# Altium schematic sheet Sheet1.SchDoc
size A3; SheetNumber: 1; SheetTotal: 1
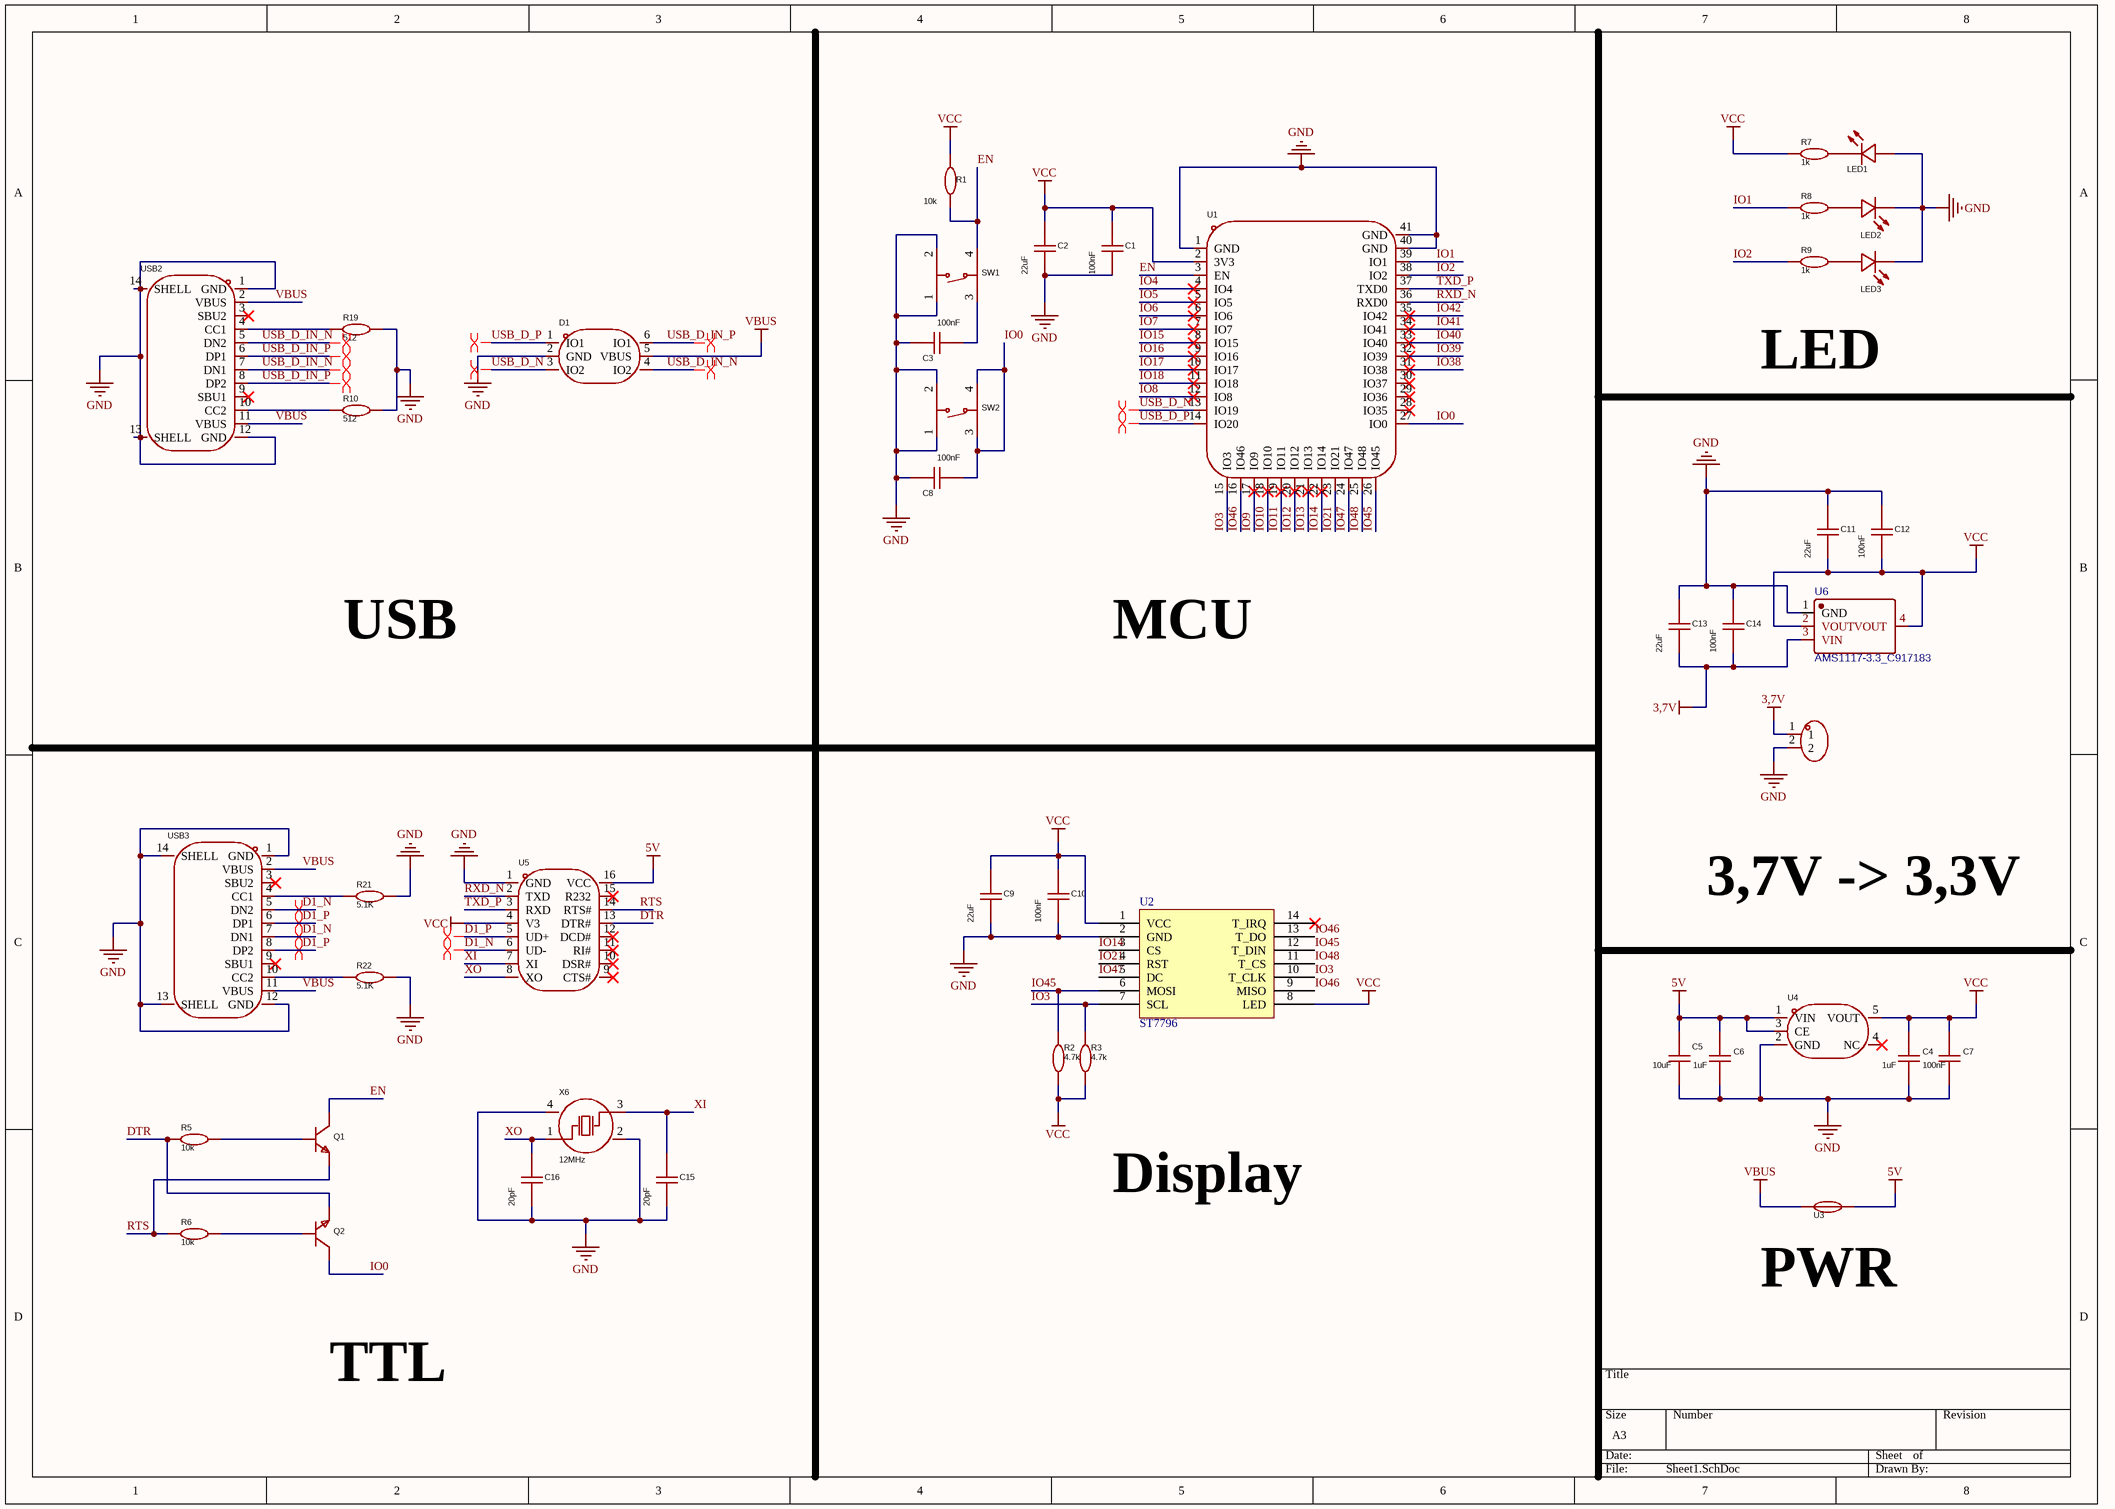
[diagram p0: Sheet1.SchDoc]

## Parts
C1  100nF  [C0402]
C2  22uF  [C0402]
C3  100nF  [C0402]
C4  1uF  [C0402]
C5  10uF  [C0402]
C6  1uF  [C0402]
C7  100nF  [C0402]
C8  100nF  [C0402]
C9  22uF  [C0402]
C10  100nF  [C0402]
C11  22uF  [C0402]
C12  100nF  [C0402]
C13  22uF  [C0402]
C14  100nF  [C0402]
C15  20pF  [C0402]
C16  20pF  [C0402]
D1  USBLC6-2SC6  [SOT-23-6_L2.9-W1.6-P0.95-LS2.8-BL]  (value not drawn)
LED1  MHT192WDT-CYAN  [LED0603-Yel]  (value not drawn)
LED2  MHT192WDT-CYAN  [LED0603-R-RD_BLUE]  (value not drawn)
LED3  MHT192WDT-CYAN  [LED0603-R-RD_BLUE]  (value not drawn)
Q1  S8050  [SOT-23-3_L2.9-W1.3-P1.90-LS2.4-BR]  (value not drawn)
Q2  S8050  [SOT-23-3_L2.9-W1.3-P1.90-LS2.4-BR]  (value not drawn)
R1  10k  [R0402]
R2  4.7k  [R0402]
R3  4.7k  [R0402]
R5  10k  [R0402]
R6  10k  [R0402]
R7  1k  [R0402]
R8  1k  [R0402]
R9  1k  [R0402]
R10  512  [R0402]
R19  512  [R0402]
R21  5.1K  [R0402]
R22  5.1K  [R0402]
SW1  TS-1089S-02526  [SW-SMD_4P-L4.2-W3.3-P2.15-LS5.1]  (value not drawn)
SW2  TS-1089S-02526  [SW-SMD_4P-L4.2-W3.3-P2.15-LS5.1]  (value not drawn)
U1  ESP32-S3-WROOM-1-N16R2  [WIRELM-SMD_ESP32-S3-WROOM-1]  (value not drawn)
U2  ST7796  [ST7796]
U3  SMD0805B050TF  [F0805]  (value not drawn)
U4  RT9013-33GB-JSM  [SOT-23-5_L2.9-W1.6-P0.95-LS2.8-BR]  (value not drawn)
U5  CH340G  [SOIC-16_L9.9-W3.9-P1.27-LS6.0-BL]  (value not drawn)
U6  AMS1117-3.3_C917183  [SOT-223-3_L6.7-W3.7-P2.30-LS7.0-BR]
U7  WAFER-XH254Z-2A  [CONN-TH_2P-P2.50_XH-2A_3045048]  (value not drawn)
USB2  TYPE-C 16PIN 2MD(073)  [USB-C-SMD_TYPE-C-6PIN-2MD-073]  (value not drawn)
USB3  TYPE-C 16PIN 2MD(073)  [USB-C-SMD_TYPE-C-6PIN-2MD-073]  (value not drawn)
X6  12MHz  [CRYSTAL-SMD_4P-L3.2-W2.5-BL]

## Nets
3,7V: C13.1 C14.1 U6.3(VIN) U7.1
5V: C5.1 C6.2 U3.2 U4.1(VIN) U4.3(CE) U5.16(VCC)
GND: C1.1 C2.1 C3.2 C4.1 C5.2 C6.1 C7.1 C8.2 C9.1 C10.1 C11.2 C12.2 C13.2 C14.2 C15.1 C16.1 D1.2(GND) LED1.2(K) LED2.1(A) LED3.1(A) R10.1 R19.1 R21.1 R22.1 SW1.1 SW1.2 SW2.1 SW2.2 U1.1(GND) U1.40(GND) U1.41(GND) U2.2(GND) U4.2(GND) U5.1(GND) U6.1(GND) U7.2 USB2.1(GND) USB2.12(GND) USB2.13(SHELL) USB2.14(SHELL) USB3.1(GND) USB3.12(GND) USB3.13(SHELL) USB3.14(SHELL) X6.2(GND) X6.4(GND)
VBUS: D1.5(VBUS) U3.1 USB2.2(VBUS) USB2.11(VBUS) USB3.2(VBUS) USB3.11(VBUS)
VCC: C1.2 C2.2 C4.2 C7.2 C9.2 C10.2 C11.1 C12.1 R1.2 R2.2 R3.2 R7.2 U1.2(3V3) U2.1(VCC) U2.8(LED) U4.5(VOUT) U5.4(V3) U6.2(VOUT) U6.4(VOUT)
D1_N: U5.6(UD-) USB3.5(DN2) USB3.7(DN1)
D1_P: U5.5(UD+) USB3.6(DP1) USB3.8(DP2)
DTR: Q2.2(E) R5.2 U5.13(DTR#)
EN: Q1.3(C) R1.1 SW1.4 U1.3(EN)
IO0: C8.1 Q2.3(C) SW2.3 SW2.4 U1.27(IO0)
IO1: R8.2 U1.39(IO1)
IO2: R9.2 U1.38(IO2)
IO3: R3.1 U1.15(IO3) U2.7(SCL) U2.10(T_CLK)
IO4: U1.4(IO4)
IO5: U1.5(IO5)
IO6: U1.6(IO6)
IO7: U1.7(IO7)
IO8: U1.12(IO8)
IO9: U1.17(IO9)
IO10: U1.18(IO10)
IO11: U1.19(IO11)
IO12: U1.20(IO12)
IO13: U1.21(IO13)
IO14: U1.22(IO14) U2.3(CS)
IO15: U1.8(IO15)
IO16: U1.9(IO16)
IO17: U1.10(IO17)
IO18: U1.11(IO18)
IO21: U1.23(IO21) U2.4(RST)
IO38: U1.31(IO38)
IO39: U1.32(IO39)
IO40: U1.33(IO40)
IO41: U1.34(IO41)
IO42: U1.35(IO42)
IO45: R2.1 U1.26(IO45) U2.6(MOSI) U2.12(T_DIN)
IO46: U1.16(IO46) U2.9(MISO) U2.13(T_DO)
IO47: U1.24(IO47) U2.5(DC)
IO48: U1.25(IO48) U2.11(T_CS)
RTS: Q1.2(E) R6.2 U5.14(RTS#)
RXD_N: U1.36(RXD0) U5.2(TXD)
TXD_P: U1.37(TXD0) U5.3(RXD)
USB_D_IN_N: D1.4(IO2) USB2.5(DN2) USB2.7(DN1)
USB_D_IN_P: D1.6(IO1) USB2.6(DP1) USB2.8(DP2)
USB_D_N: D1.3(IO2) U1.13(IO19)
USB_D_P: D1.1(IO1) U1.14(IO20)
XI: C15.2 U5.7(XI) X6.3(OSC2)
XO: C16.2 U5.8(XO) X6.1(OSC1)
NetC3_1: C3.1 SW1.3
NetLED1_1: LED1.1(A) R7.1
NetLED2_2: LED2.2(K) R8.1
NetLED3_2: LED3.2(K) R9.1
NetQ1_1: Q1.1(B) R5.1
NetQ2_1: Q2.1(B) R6.1
NetR10_2: R10.2 USB2.10(CC2)
NetR19_2: R19.2 USB2.4(CC1)
NetR21_2: R21.2 USB3.4(CC1)
NetR22_2: R22.2 USB3.10(CC2)

Not connected (* = marked no-connect by the designer): U1 28(IO35)* 29(IO36)* 30(IO37)*; U2 14(T_IRQ)*; U4 4(NC)*; U5 9(CTS#)* 10(DSR#)* 11(RI#)* 12(DCD#)* 15(R232)*; USB2 3(SBU2)* 9(SBU1)*; USB3 3(SBU2)* 9(SBU1)*

## Layout directives
differential pair: D1_N, D1_P, USB_D_IN_N, USB_D_IN_P, USB_D_N, USB_D_P

## Notes on the sheet
- LED
- USB
- MCU
- 3,7V -> 3,3V
- Display
- (near U3) PWR
- TTL

## Library data of the parts
C1 C3 C7 C8 C10 C12 C14 = 100n_22u: Manufacturer: YAGEO(国巨); Symbol: CC0603KRX7R9BB104; Add into BOM: yes; Tolerance: ±10%; Device: CC0603KRX7R9BB104; LCSC Part Name: 100nF ±10% 50V; Supplier Part: C14663; Manufacturer Part: CC0603KRX7R9BB104; Supplier Footprint: 0603; JLCPCB Part Class: Basic Part; Datasheet: https://atta.szlcsc.com/upload/public/pdf/source/20180910/C282072_33301C7F631E79921B82A8DAC6BCC5B3.pdf; Supplier: LCSC; Convert to PCB: yes; Value: 100nF
C2 C4-C6 C9 C11 C13 C15 C16 = 100n_22u: Manufacturer: YAGEO(国巨); Symbol: CC0603KRX7R9BB104; Add into BOM: yes; Value: 100nF; Tolerance: ±10%; Device: CC0603KRX7R9BB104; LCSC Part Name: 100nF ±10% 50V; Supplier Part: C14663; Manufacturer Part: CC0603KRX7R9BB104; Supplier Footprint: 0603; JLCPCB Part Class: Basic Part; Datasheet: https://atta.szlcsc.com/upload/public/pdf/source/20180910/C282072_33301C7F631E79921B82A8DAC6BCC5B3.pdf; Supplier: LCSC; Convert to PCB: yes
D1 = USBLC6-2SC6_C2827654: Manufacturer: TECH PUBLIC(台舟); Add into BOM: yes; polarity: Unidirectional; Reverse Stand-Off Voltage (Vrwm): 5V; Maximum Clamping Voltage: 12V; Peak Pulse Current (Ipp): 6A; Peak Pulse Power Dissipation (Ppp): 150W; Breakdown Voltage: 6V; Reverse Leakage Current (Ir): 80nA; Number of Lines: Dual channel; level of protection: IEC 61000-4-2; Type: ESD; Symbol: USBLC6-2SC6_C2827654; Device: USBLC6-2SC6_C2827654; LCSC Part Name: ESD，可防30kV静电; Supplier Part: C2827654; Manufacturer Part: USBLC6-2SC6; Supplier Footprint: SOT-23-6; JLCPCB Part Class: Extended Part; Datasheet: https://atta.szlcsc.com/upload/public/pdf/source/20210810/FBD75DE717D6D97BAC6DD7F2B5C09DCD.pdf; Supplier: LCSC; Convert to PCB: yes; Operating Temperature: -55℃~+125℃
LED1-LED3 = LED: Manufacturer: MEIHUA(美华); Add into BOM: yes; Power Dissipation: 100mW; Forward Current: 20mA; Lens Color: 雾状绿透镜; Viewing Angle: 130°; Symbol: MHT192WDT-CYAN; Device: MHT192WDT-CYAN; LCSC Part Name: MHT192WDT-CYAN; Supplier Part: C496821; Manufacturer Part: MHT192WDT-CYAN; Supplier Footprint: 0603; JLCPCB Part Class: Extended Part; Datasheet: https://atta.szlcsc.com/upload/public/pdf/source/20200316/C496821_3E439A7DBE0C3627796F4F9071B8BDF1.pdf; Supplier: LCSC; Convert to PCB: yes; Emitted Color: -; Dominant Wavelength: -; Peak Wavelength: -; Diode Configuration: -; Color Temperature: -; Mounting Sytle: -; Operating Temperature: -40℃~+85℃
Q1 Q2 = S8050_C2891804: Manufacturer: YONGYUTAI(永裕泰); Add into BOM: yes; DC Current Gain (hFE@Ic,Vce): 400@50mA,1V; Collector Cut-Off Current (Icbo): 1uA; Collector-Emitter Saturation Voltage (VCE(sat)@Ic,Ib): 500mV@500mA,50mA; Symbol: S8050_C2891804; Device: S8050_C2891804; LCSC Part Name: NPN 电流:500mA 耐压:25V; Supplier Part: C2891804; Manufacturer Part: S8050; Supplier Footprint: SOT-23; JLCPCB Part Class: Extended Part; Datasheet: https://atta.szlcsc.com/upload/public/pdf/source/20210901/5347316A10609C628D4D69AE01446E5B.pdf; Supplier: LCSC; Convert to PCB: yes; Transition Frequency (fT): -; Operating Temperature: -
R1-R3 R5-R10 R19 R21 R22 = 10k: Manufacturer: YAGEO(国巨); Symbol: RC0402FR-0710KL; Add into BOM: yes; Value: 10kΩ; Tolerance: ±1%; Temperature Coefficient: ±100ppm/℃; Device: RC0402FR-0710KL; LCSC Part Name: 厚膜电阻 10kΩ ±1% 62.5mW; Supplier Part: C60490; Manufacturer Part: RC0402FR-0710KL; Supplier Footprint: 0402; JLCPCB Part Class: Extended Part; Datasheet: https://atta.szlcsc.com/upload/public/pdf/source/20170925/C131467_1506321478108990263.pdf; Supplier: LCSC; Convert to PCB: yes; Type: Thick Film Resistors; Operating Temperature Range: -55℃~+155℃
SW1 SW2 = TS-1089S-02526: Manufacturer: XUNPU(讯普); Add into BOM: yes; Circuit: SPST; Actuator Style: Oval button; Switch Length: 4.2mm; Switch Width: 3.25mm; Switch Height: 2.5mm; Contact Current: 50mA; Voltage Rating (DC): 12V; Symbol: TS-1089S-02526; Device: TS-1089S-02526; LCSC Part Name: 4.2*3.25*2.5mm 立贴 轻触开关; Supplier Part: C455282; Manufacturer Part: TS-1089S-02526; Supplier Footprint: SMD,3.3x4.2mm; JLCPCB Part Class: Extended Part; Datasheet: https://atta.szlcsc.com/upload/public/pdf/source/20191118/C455282_2E86A26A9CC4FEF4662951C4D45ED672.pdf; Supplier: LCSC; Convert to PCB: yes; Mounting Style: Brick nogging; With Lamp: -; Mechanical Life: -
U1 = ESP32-S3-WROOM-1-N16R2: Manufacturer: ESPRESSIF(乐鑫); Symbol: ESP32-S3-WROOM-1(N16R2); Add into BOM: yes; Device: ESP32-S3-WROOM-1-N16R2; LCSC Part Name: 通用型Wi-Fi+低功耗蓝牙MCU模组; Supplier Part: C2913205; Manufacturer Part: ESP32-S3-WROOM-1-N16R2; Supplier Footprint: SMD,18x25.5mm; JLCPCB Part Class: Extended Part; Datasheet: https://atta.szlcsc.com/upload/public/pdf/source/20220628/A2AC12B3C87735CAEB7EBE2DBE80936C.pdf; Supplier: LCSC; Convert to PCB: yes
U3 = SMD0805B050TF: Manufacturer: Brightking(君耀电子); Add into BOM: yes; Operating Voltage (Max): 6V; Current Rating (Max): 100A; Hold Current: 500mA; Trip Current: 1A; Resistance - Initial (Ri) (Min): 150mΩ; Maximum Time to Trip: 100ms; Symbol: SMD0805B050TF; Device: SMD0805B050TF; LCSC Part Name: 6V 500mA 0805自恢复; Supplier Part: C269104; Manufacturer Part: SMD0805B050TF; Supplier Footprint: 0805; JLCPCB Part Class: Extended Part; Datasheet: https://atta.szlcsc.com/upload/public/pdf/source/20180913/C269107_1BF28CF6F4C5BFD5B8CD673BC8D2B923.pdf; Supplier: LCSC; Convert to PCB: yes; Operating Temperature: -40℃~+85℃；-40℃~+85℃；-40℃~+85℃
U4 = RT9013-33GB-JSM: Manufacturer: JSMSEMI(杰盛微); Add into BOM: yes; Symbol: RT9013-33GB-JSM; Device: RT9013-33GB-JSM; LCSC Part Name: RT9013-33GB-JSM; Supplier Part: C39846929; Manufacturer Part: RT9013-33GB-JSM; Supplier Footprint: SOT-23-5; JLCPCB Part Class: Extended Part; Datasheet: https://atta.szlcsc.com/upload/public/pdf/source/20240812/6C3DB71E826AA30FCDAD46145DB01E41.pdf; Supplier: LCSC; Convert to PCB: yes
U5 = CH340G: Manufacturer: WCH(南京沁恒); Add into BOM: yes; Applications Function: USB to UART; Supply Voltage: 5V；3.3V; Data Rate: 2Mbps; Symbol: CH340G; Device: CH340G; LCSC Part Name: USB转串口芯片CH340 USB转串口芯片 CH340; Supplier Part: C14267; Manufacturer Part: CH340G; Supplier Footprint: SOP-16; JLCPCB Part Class: Extended Part; Datasheet: https://atta.szlcsc.com/upload/public/pdf/source/20240313/8510303D24D987FBF1AD30058571F10E.pdf; Supplier: LCSC; Convert to PCB: yes; Operating Temperature: -40℃~+85℃
U6 = AMS1117-3.3_C917183: Manufacturer: JSMSEMI(杰盛微); Contributor: LCSC; Supplier: LCSC; Supplier Part: C917183; Manufacturer Part: AMS1117-3.3; JLCPCB Part Class: Extended Part; spicePre: U; spiceSymbolName: AMS1117-3.3_C917183
U7 = WAFER-XH254Z-2A: Manufacturer: HANBO(汉博); Add into BOM: yes; Pins Structure: 1x2P; Pitch: 2.54mm; Reference Series: XH; Number of PINs Per Row: 2; Current Rating (Max): 3A; Symbol: WAFER-XH254Z-2A; Device: WAFER-XH254Z-2A; LCSC Part Name: WAFER-XH254Z-2A; Supplier Part: C7432682; Manufacturer Part: WAFER-XH254Z-2A; Supplier Footprint: 插件,P=2.5mm; JLCPCB Part Class: Extended Part; Datasheet: https://atta.szlcsc.com/upload/public/pdf/source/20230718/3B4FABA5D38EFB02DAF74E7C2B33D98F.pdf; Supplier: LCSC; Convert to PCB: yes; Mounting Style: Straight; Number of Pins: 2P; Number of Rows: 1; Operating Temperature Range: -25℃~+85℃
USB2 USB3 = TYPE-C 16PIN 2MD(073): Manufacturer: SHOU HAN(首韩); Add into BOM: yes; Gender: Female; Number of Contacts: 16P; Number of Ports: 1; Current Rating - Power (Max): 5A; Rated Voltage (Max): 5V; Connect-Disconnect Life: 5000 Cuts; Core Colour: Black; Symbol: TYPE-C 16PIN 2MD(073); Device: TYPE-C 16PIN 2MD(073); LCSC Part Name: Type-C 母 卧贴; Supplier Part: C2765186; Manufacturer Part: TYPE-C 16PIN 2MD(073); Supplier Footprint: SMD; JLCPCB Part Class: Extended Part; Datasheet: https://atta.szlcsc.com/upload/public/pdf/source/20211123/39B17C16241EAC15C5E277BDA434118E.pdf; Supplier: LCSC; Convert to PCB: yes; Connector Type: Type-C; Standard: USB 3.1; Mounting Style: Horizontal attachment; Operating Temperature Range: -25℃~+85℃
X6 = X322512MSB4SI: Manufacturer: YXC(扬兴晶振); Add into BOM: yes; Crystal Type: Surface Mount Crystal; Normal temperature Frequency Tolerance: ±10ppm; Frequency Stability(Full temperature range): ±20ppm; Symbol: X322512MSB4SI; Device: X322512MSB4SI; LCSC Part Name: 12MHz ±10ppm 20pF; Supplier Part: C9002; Manufacturer Part: X322512MSB4SI; Supplier Footprint: SMD3225-4P; JLCPCB Part Class: Basic Part; Datasheet: https://atta.szlcsc.com/upload/public/pdf/source/20240329/19D5F850207469550BEB00D7DFEDBC7A.pdf; Supplier: LCSC; Convert to PCB: yes; Value: 12MHz